# EAGLE design BluetoothModule (EAGLE 6.3)
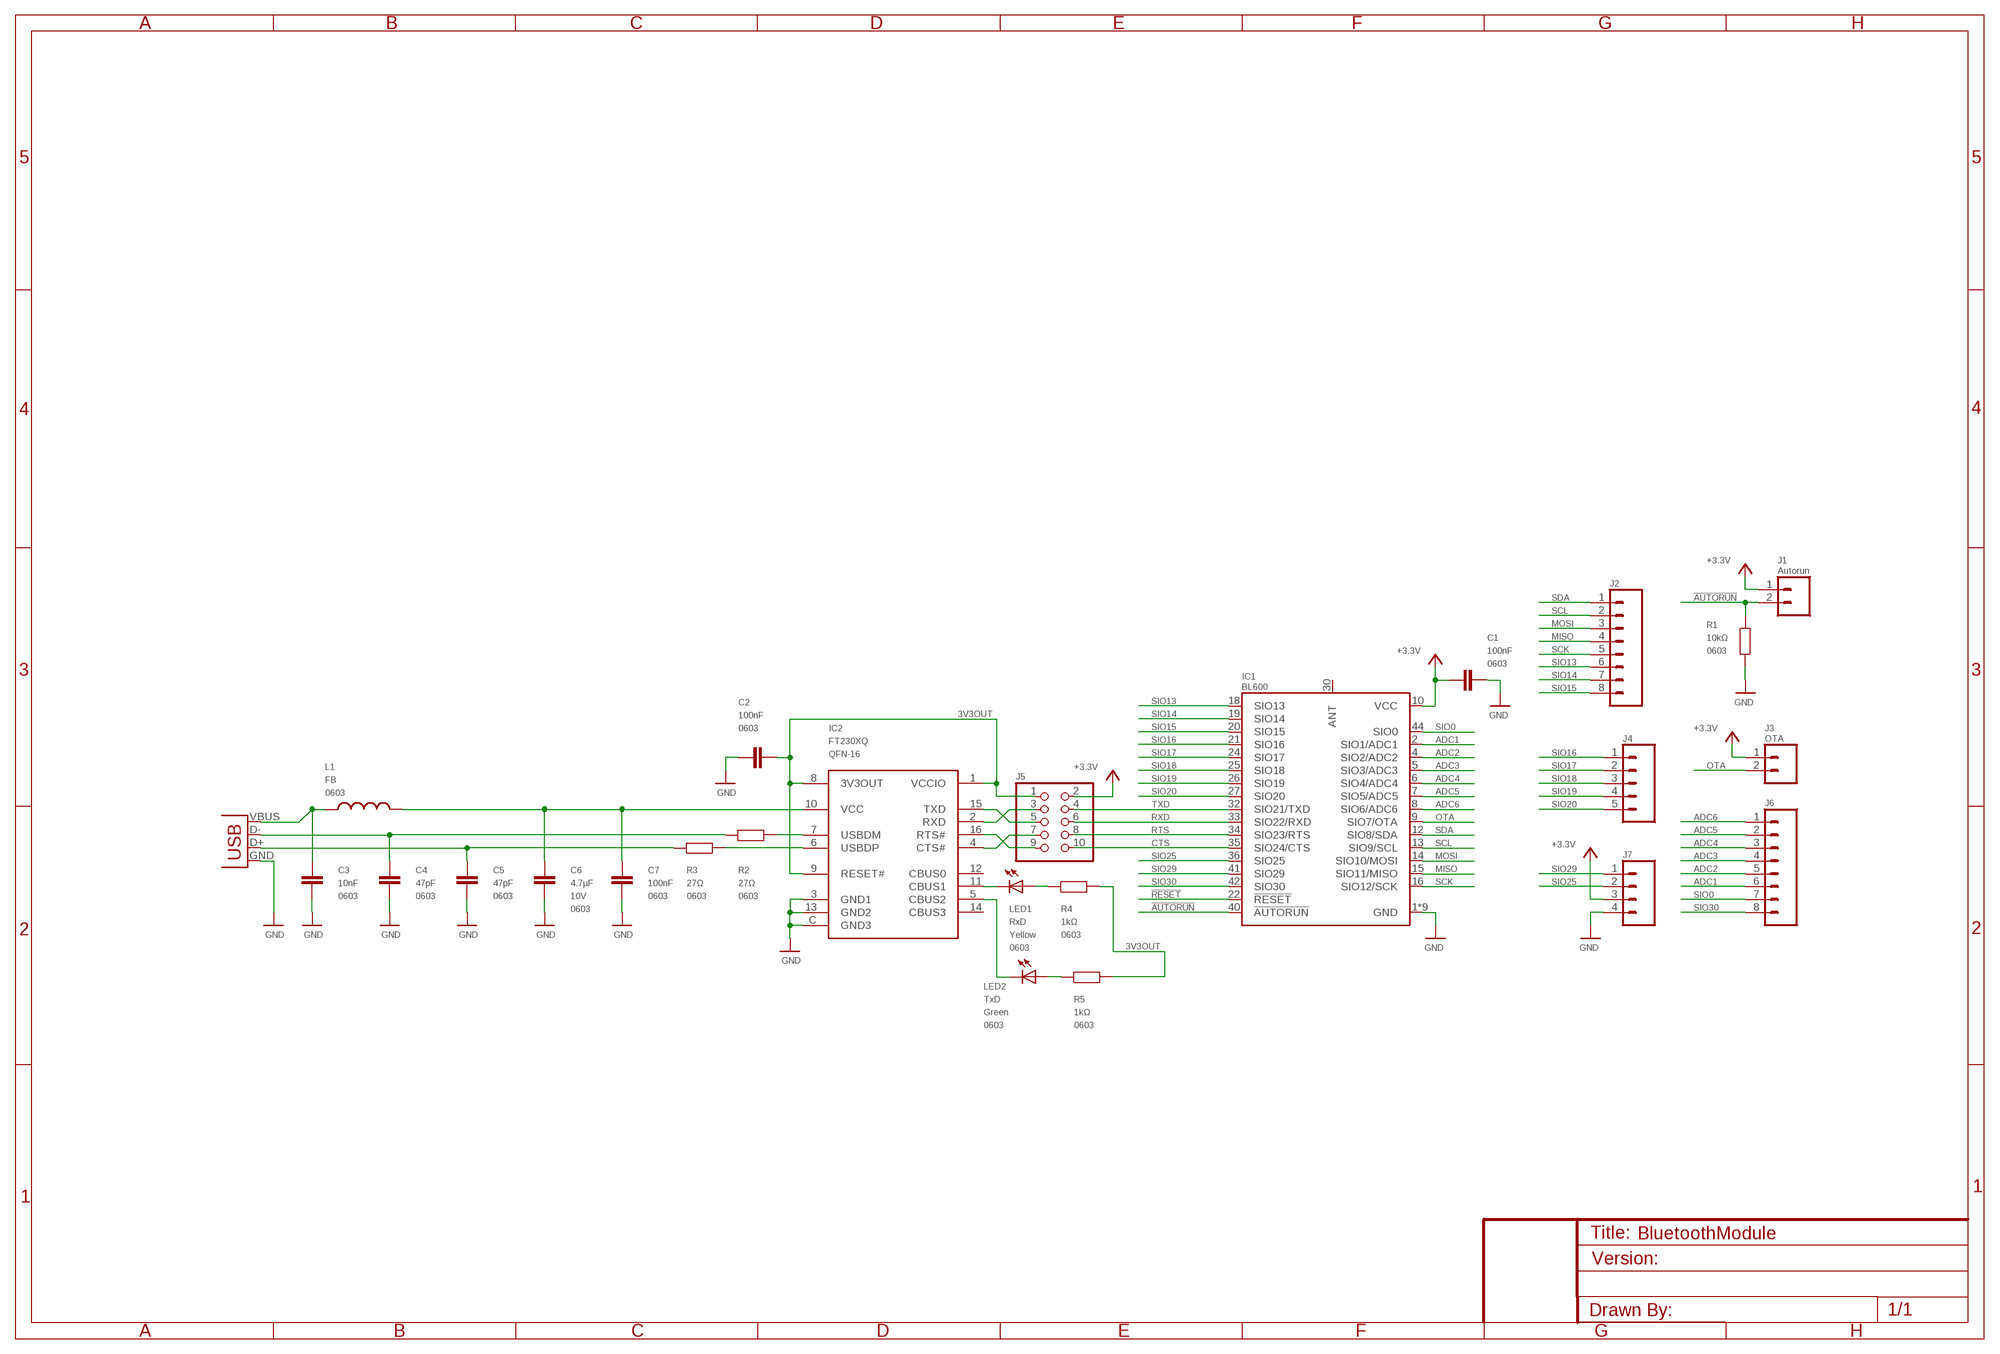
[diagram p0: schematic, sheet 1]

## Parts
C1  100nF  CAP0603  [0603]
C2  100nF  CAP0603  [0603]
C3  10nF  CAP0603  [0603]
C4  47pF  CAP0603  [0603]
C5  47pF  CAP0603  [0603]
C6  4.7µF  CAP0603  [0603]
C7  100nF  CAP0603  [0603]
IC1  BL600  [BL600-SA]
IC2  FT230XQ  [QFN4X4-16]
J1  Autorun  M02PTH  [1X02]
J2  M08STD  [1X08]
J3  OTA  M02PTH  [1X02]
J4  M05PTH  [1X05]
J5  PINHD-2X5  [2X05]
J6  M08STD  [1X08]
J7  M04PTH  [1X04]
J8  USB  USB-MICROB  [USB-MICROB]
L1  FB  INDUCTOR0603  [0603]
LED1  RxD  LED0603  [LED-0603]
LED2  TxD  LED0603  [LED-0603]
R1  10kΩ  RESISTOR0603  [0603]
R2  27Ω  RESISTOR0603  [0603]
R3  27Ω  RESISTOR0603  [0603]
R4  1kΩ  RESISTOR0603  [0603]
R5  1kΩ  RESISTOR0603  [0603]

## Nets
3V3OUT: C2.2 IC2.1(VCCIO) IC2.8(3V3OUT) IC2.9(RESET#) J5.1 R4.2 R5.2
!AUTORUN: IC1.40(!AUTORUN) J1.2 R1.2
!RESET: IC1.22(!RESET)
+3V3: C1.2 IC1.10(VCC) J1.1 J3.1 J5.2 J7.3 ; supply symbol labelled +3.3V
ADC1: IC1.2(SIO1/ADC1) J6.6
ADC2: IC1.4(SIO2/ADC2) J6.5
ADC3: IC1.5(SIO3/ADC3) J6.4
ADC4: IC1.6(SIO4/ADC4) J6.3
ADC5: IC1.7(SIO5/ADC5) J6.2
ADC6: IC1.8(SIO6/ADC6) J6.1
CTS: IC1.35(SIO24/CTS) J5.10
GND: C1.1 C2.1 C3.1 C4.1 C5.1 C6.1 C7.1 IC1.1(GND) IC1.3(GND) IC1.11(GND) IC1.17(GND) IC1.28(GND) IC1.29(GND) IC1.31(GND) IC1.37(GND) IC1.43(GND) IC2.3(GND1) IC2.13(GND2) IC2.C(GND3) J7.4 J8.GND R1.1
MISO: IC1.15(SIO11/MISO) J2.4
MOSI: IC1.14(SIO10/MOSI) J2.3
N$1: IC2.4(CTS#) J5.7
N$2: IC2.16(RTS#) J5.9
N$3: IC2.2(RXD) J5.3
N$4: IC2.15(TXD) J5.5
N$5: C3.2 J8.VBUS L1.1
N$6: LED2.A R5.1
N$7: IC2.11(CBUS1) LED1.C
N$8: IC2.5(CBUS2) LED2.C
N$9: LED1.A R4.1
N$10: C6.2 C7.2 IC2.10(VCC) L1.2
N$11: C4.2 J8.D- R2.1
N$12: C5.2 J8.D+ R3.1
N$13: IC2.6(USBDP) R3.2
N$14: IC2.7(USBDM) R2.2
OTA: IC1.9(SIO7/OTA) J3.2
RTS: IC1.34(SIO23/RTS) J5.8
RXD: IC1.33(SIO22/RXD) J5.6
SCK: IC1.16(SIO12/SCK) J2.5
SCL: IC1.13(SIO9/SCL) J2.2
SDA: IC1.12(SIO8/SDA) J2.1
SIO0: IC1.44(SIO0) J6.7
SIO13: IC1.18(SIO13) J2.6
SIO14: IC1.19(SIO14) J2.7
SIO15: IC1.20(SIO15) J2.8
SIO16: IC1.21(SIO16) J4.1
SIO17: IC1.24(SIO17) J4.2
SIO18: IC1.25(SIO18) J4.3
SIO19: IC1.26(SIO19) J4.4
SIO20: IC1.27(SIO20) J4.5
SIO25: IC1.36(SIO25) J7.2
SIO29: IC1.41(SIO29) J7.1
SIO30: IC1.42(SIO30) J6.8
TXD: IC1.32(SIO21/TXD) J5.4
Unconnected: IC1.30(ANT) IC2.12(CBUS0) IC2.14(CBUS3)

## Library data of the parts
C1-C5 C7 = freetronics-master-v1:CAP: Capacitor Standard 0603 ceramic capacitor, and 0.1" leaded capacitor.; PACKAGE: 0603
C6 = freetronics-master-v1:CAP: Capacitor Standard 0603 ceramic capacitor, and 0.1" leaded capacitor.; PACKAGE: 0603; VOLTAGE: 10V
IC1 = freetronics-luke:BL600: Laird BL600 Bluetooth Low Energy module
IC2 = serial:FT230XQ; PACKAGE: QFN-16; VALUE2: FT230XQ
J1 J3 = freetronics-master-v1:M02: Header 2 Standard 2-pin 0.1" header. Use with straight break away headers (SKU : PRT-00116), right angle break away headers (PRT-00553), swiss pins (PRT-00743), machine pins (PRT-00117), and female headers (PRT-00115). Molex polarized connector foot print use with SKU : PRT-08233 with associated crimp pins and housings.
J2 J6 = freetronics-master-v1:M08: Header 8 Standard 8-pin 0.1" header. Use with straight break away headers (SKU : PRT-00116), right angle break away headers (PRT-00553), swiss pins (PRT-00743), machine pins (PRT-00117), and female headers (PRT-00115).
J4 = freetronics-master-v1:M05: Header 5 Standard 5-pin 0.1" header. Use with straight break away headers (SKU : PRT-00116), right angle break away headers (PRT-00553), swiss pins (PRT-00743), machine pins (PRT-00117), and female headers (PRT-00115). Molex polarized connector foot print use with SKU : PRT-08230 with associated crimp pins and housings.
J5 = pinhead:PINHD-2X5: PIN HEADER
J7 = freetronics-master-v1:M04: Header 4 Standard 4-pin 0.1" header. Use with straight break away headers (SKU : PRT-00116), right angle break away headers (PRT-00553), swiss pins (PRT-00743), machine pins (PRT-00117), and female headers (PRT-00115). Molex polarized connector foot print use with SKU : PRT-08231 with associated crimp pins and housings.
J8 = freetronics-master-v1:USB: USB Connectors USB-B-PTH is fully proven SKU : PRT-00139 USB-miniB is fully proven SKU : PRT-00587 USB-A-PCB is untested. USB-A-H is throughly reviewed, but untested. Spark Fun Electronics SKU : PRT-00437 USB-B-SMT is throughly reviewed, but untested. Needs silkscreen touching up. USB-A-S has not been used/tested USB-MB-H has not been used/tested
L1 = freetronics-master-v1:INDUCTOR: Inductors Basic Inductor/Choke - 0603 and 1206. Footprints are not proven and vary greatly between part numbers.; PACKAGE: 0603
LED1 = freetronics-master-v1:LED: LEDs Standard schematic elements and footprints for 5mm, 3mm, 1206, and 0603 sized LEDs. 5mm - Spark Fun Electronics SKU : COM-00529 (and others); COLOR: Yellow; PACKAGE: 0603
LED2 = freetronics-master-v1:LED: LEDs Standard schematic elements and footprints for 5mm, 3mm, 1206, and 0603 sized LEDs. 5mm - Spark Fun Electronics SKU : COM-00529 (and others); COLOR: Green; PACKAGE: 0603
R1-R5 = freetronics-master-v1:RESISTOR: Resistor Basic schematic elements and footprints for 0603, 1206, and PTH 1/10th watt (small) resistors.; PACKAGE: 0603

## Board
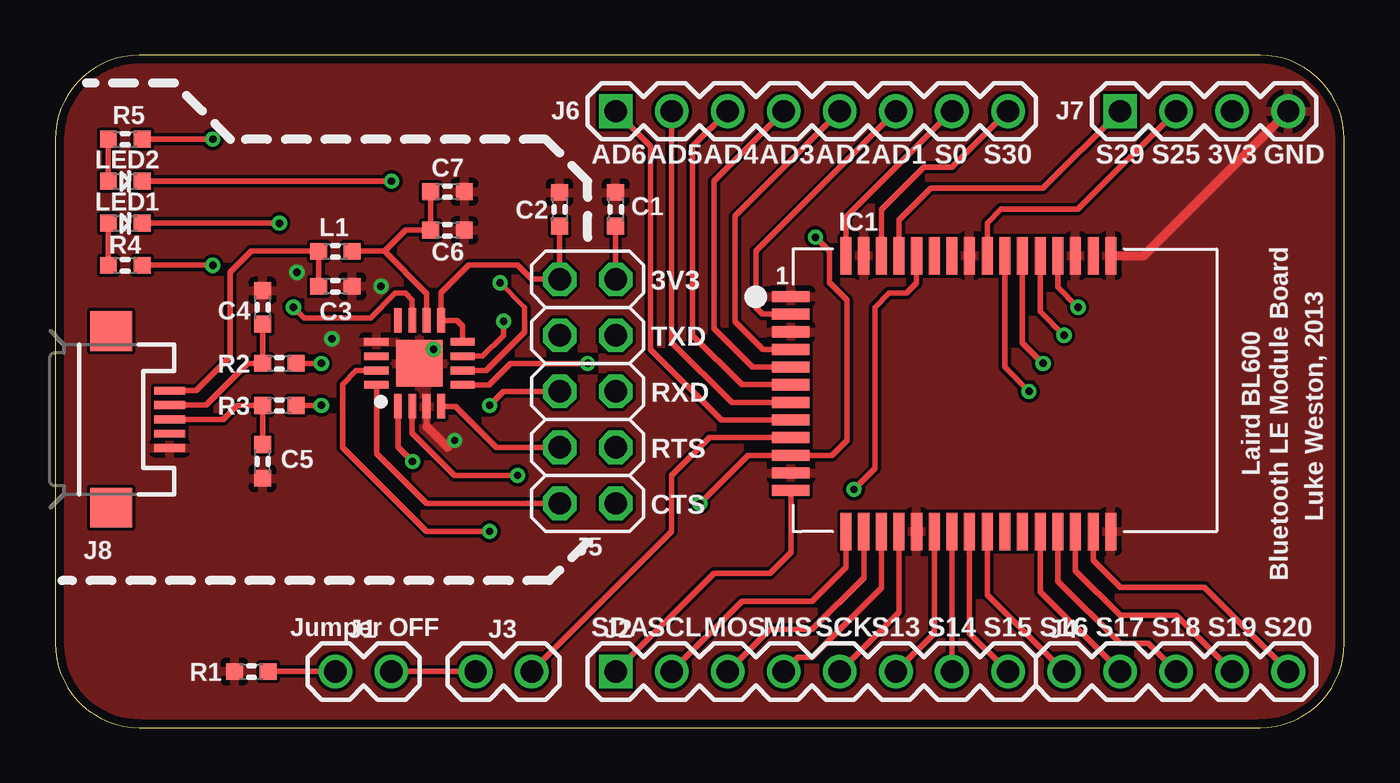
[diagram p1: board, top side]
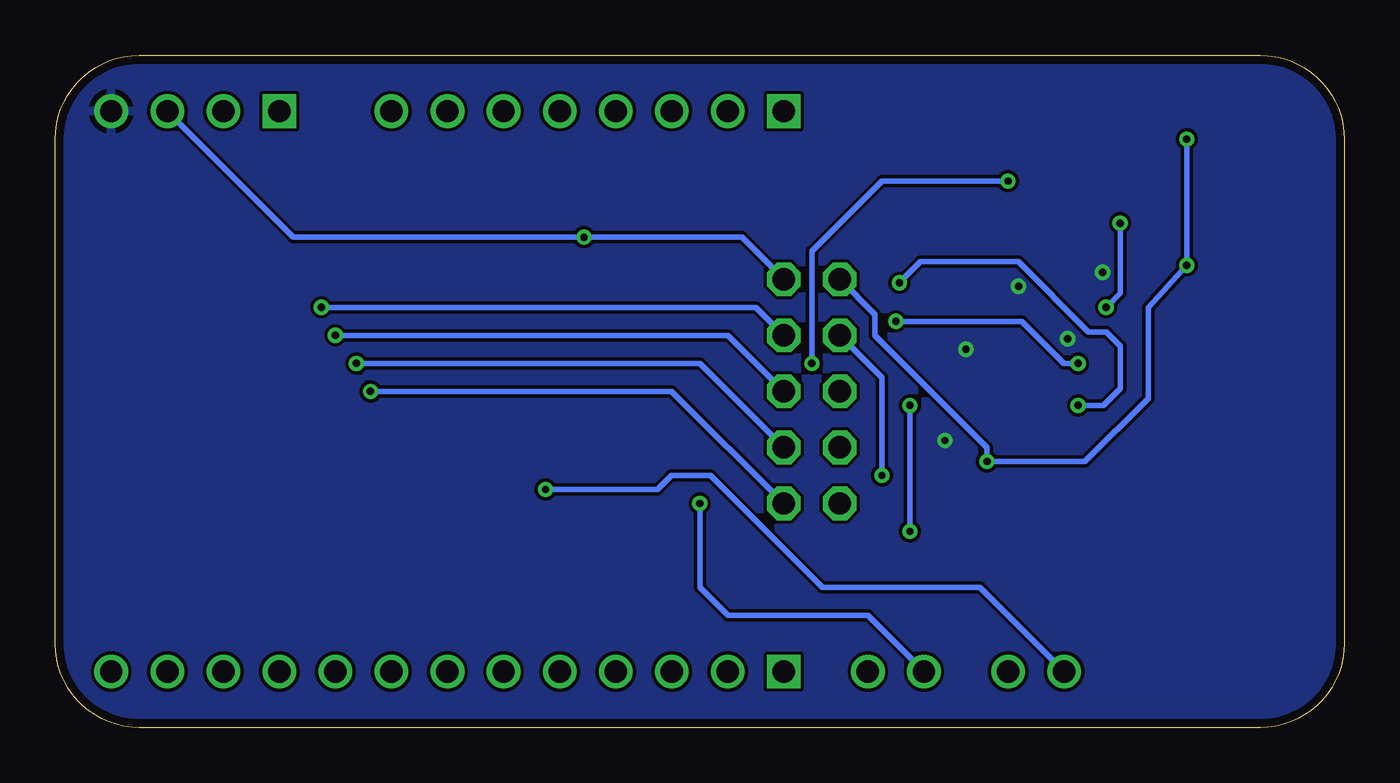
[diagram p2: board, bottom side, seen from below]

Size 58.42 x 30.48 mm. Coordinates in mm from the lower left corner, seen from the top.
Outline: 3.81,30.48 arc90 0,26.67 0,3.81 arc90 3.81,0 54.61,0 arc90 58.42,3.81 58.42,26.67 arc90 54.61,30.48 3.81,30.48
Copper layers (1*16): Top 0.0356mm / dielectric 1.5011mm / Bottom 0.0356mm
Design rules "LaenPCBOrder *": minimum track width 6mil, minimum drill 13mil, track to track 6mil, track to pad 6mil, pad to pad 6mil, via to via 6mil, smd to smd 6mil, copper to edge 15mil, drill to drill 6mil, minimum pad ring 7mil, minimum via ring 7mil, stop-mask expansion 4mil, vias tented up to drill 14mil, thermal gap 10mil

### Footprints (pad centres in the part's own frame; a part is rotated, then mirrored left to right if it is on the bottom)
0603 = smd 0.762 x 0.762: 1 -0.762,0; 2 0.762,0
BL600-SA = smd 1.7 x 0.5: 1 -2.5,10.65; 2 -2.5,9.85; 3 -2.5,9.05; 4 -2.5,8.25; 5 -2.5,7.45; 6 -2.5,6.65; 7 -2.5,5.85; 8 -2.5,5.05; 9 -2.5,4.25; 10 -2.5,3.45; 11 -2.5,2.65; 12 -2.5,1.85 | smd 0.5 x 1.7: 13 0,0; 14 0.8,0; 15 1.6,0; 16 2.4,0; 17 3.2,0; 18 4,0; 19 4.8,0; 20 5.6,0; 21 6.4,0; 22 7.2,0; 23 8,0; 24 8.8,0; 25 9.6,0; 26 10.4,0; 27 11.2,0; 28 12,0; 29 12,12.5; 30 11.2,12.5; 31 10.4,12.5; 32 9.6,12.5; 33 8.8,12.5; 34 8,12.5; 35 7.2,12.5; 36 6.4,12.5; 37 5.6,12.5; 38 4.8,12.5; 39 4,12.5; 40 3.2,12.5; 41 2.4,12.5; 42 1.6,12.5; 43 0.8,12.5; 44 0,12.5
QFN4X4-16 = smd 1.1 x 0.35: 1 -1.95,0.975; 2 -1.95,0.325; 3 -1.95,-0.325; 4 -1.95,-0.975; 9 1.95,-0.975; 10 1.95,-0.325; 11 1.95,0.325; 12 1.95,0.975 | smd 0.35 x 1.1: 5 -0.975,-1.95; 6 -0.325,-1.95; 7 0.325,-1.95; 8 0.975,-1.95; 13 0.975,1.95; 14 0.325,1.95; 15 -0.325,1.95; 16 -0.975,1.95 | smd 2.1 x 2.1: C 0,0
1X02 = drill 1.016: 1 0,0; 2 2.54,0
1X08 = drill 1.016 square: 1 0,0 | drill 1.016: 2 2.54,0; 3 5.08,0; 4 7.62,0; 5 10.16,0; 6 12.7,0; 7 15.24,0; 8 17.78,0
1X05 = drill 1.016: 1 0,0; 2 2.54,0; 3 5.08,0; 4 7.62,0; 5 10.16,0
2X05 = drill 1.016 octagon: 1 -5.08,-1.27; 2 -5.08,1.27; 3 -2.54,-1.27; 4 -2.54,1.27; 5 0,-1.27; 6 0,1.27; 7 2.54,-1.27; 8 2.54,1.27; 9 5.08,-1.27; 10 5.08,1.27
1X04 = drill 1.016 square: 1 0,0 | drill 1.016: 2 2.54,0; 3 5.08,0; 4 7.62,0
USB-MICROB = smd 0.35 x 1.4: D+ 0,2.65; D- -0.65,2.65; GND 1.3,2.65; ID 0.65,2.65; VBUS -1.3,2.65 | smd 1.8 x 1.9: MT1 -4,0; MT2 4,0
LED-0603 = smd 0.762 x 0.762: A -0.762,0; C 0.762,0

### Placement (x,y rotation side)
C1  25.4,23.5 270 top
C2  22.86,23.5 270 top
C3  12.7,20 180 top
C4  9.4,19.05 270 top
C5  9.4,12.06 90 top
C6  17.78,22.54 180 top
C7  17.78,24.29 180 top
IC1  35.84,8.89 0 top
IC2  16.51,16.51 90 top
J1  15.24,2.54 180 top
J2  25.4,2.54 0 top
J3  19.05,2.54 0 top
J4  45.72,2.54 0 top
J5  24.13,15.24 270 top
J6  25.4,27.94 0 top
J7  48.26,27.94 0 top
J8  2.54,13.97 270 top
L1  12.7,21.59 0 top
LED1  3.17,22.86 0 top
LED2  3.17,24.77 0 top
R1  8.89,2.54 0 top
R2  10.16,16.51 0 top
R3  10.16,14.61 0 top
R4  3.17,20.95 0 top
R5  3.17,26.67 0 top

### Tracks (layer width: path | path; a pad name or v marks a point on that pad's centre or on a via)
3V3OUT  (via drill 0.33)
  Top 0.254: IC2.1 15.54,12.72 v16.19,12.06 | C2.2 J5.1 21.59,20.32 20.95,20.95 18.73,20.95 17.48,19.71 IC2.9 18.21,18.46 18.46,18.21 IC2.8 | R4.2 v7.14,20.95 | v7.14,26.67 R5.2
  Bottom 0.254: J5.1 21.27,18.73 21.27,17.78 16.19,12.7 v16.19,12.06 11.75,12.06 8.89,14.92 8.89,19.05 v7.14,20.95 v7.14,26.67
!AUTORUN  (via drill 0.33)
  Top 0.254: R1.2 J1.2 | IC1.40 39.04,20.15 38.58,19.68 37.78,19.68 37.15,19.05 37.15,11.75 v36.2,10.79
  Bottom 0.254: v36.2,10.79 31.11,10.79 30.48,11.43 28.73,11.43 23.65,6.35 16.51,6.35 J1.2
+3V3  (via drill 0.33)
  Top 0.254: v34.45,22.23 35.08,21.59 35.08,20.16 35.88,19.37 35.88,13.02 35.2,12.34 IC1.10 31.39,12.34 v29.21,10.16 | C1.2 J5.2 | J1.1 J3.1
  Bottom 0.254: J7.3 47.62,22.23 v34.45,22.23 27.3,22.23 J5.2 | v29.21,10.16 29.21,6.35 27.94,5.08 21.59,5.08 J3.1
ADC1
  Top 0.254: IC1.2 32.06,18.74 31.75,19.05 31.75,21.59 J6.6
ADC2
  Top 0.254: IC1.4 32.07,17.14 30.8,18.41 30.8,23.18 J6.5
ADC3
  Top 0.254: IC1.5 31.6,16.34 29.84,18.1 29.84,24.77 J6.4
ADC4
  Top 0.254: IC1.6 31.13,15.54 28.89,17.78 28.89,26.35 J6.3
ADC5
  Top 0.254: IC1.7 30.66,14.74 27.94,17.46 J6.2
ADC6
  Top 0.254: IC1.8 30.19,13.94 26.99,17.14 26.99,26.35 J6.1
CTS  (via drill 0.33)
  Top 0.254: IC1.35 43.04,16.33 v44.13,15.24
  Bottom 0.254: v44.13,15.24 30.48,15.24 J5.10
GND  (via drill 0.33)
  Top 0.254: IC2.3 16.84,13.64 | IC2.C v17.14,17.14
  Top 0.406: IC1.29 49.33,21.39 J7.4 | 16.84,13.64 17.78,12.7
  other vias: 18.1,13.02 12.54,17.62 10.95,20.64 14.76,20
  pour Bottom: -1.27,31.75 59.69,31.75 59.69,-1.27 -1.27,-1.27
  pour Top: -1.27,31.75 59.69,31.75 59.69,-1.27 -1.27,-1.27
MISO
  Top 0.254: IC1.15 37.44,6.33 34.29,3.17 33.66,3.17 J2.4
MOSI
  Top 0.254: IC1.14 36.64,6.79 34.29,4.45 32.38,4.45 J2.3
N$1
  Top 0.254: IC2.4 18.14,14.56 20,12.7 J5.7
N$2
  Top 0.254: IC2.16 14.56,12.43 16.83,10.16 J5.9
N$3  (via drill 0.33)
  Top 0.254: IC2.2 16.18,13.34 18.1,11.43 v20.95,11.43
  Bottom 0.254: v20.95,11.43 20.95,15.88 J5.3
N$4  (via drill 0.33)
  Top 0.254: IC2.15 13.64,16.18 13.02,15.56 13.02,12.7 16.83,8.89 v19.68,8.89 | v19.68,14.61 20.32,15.24 J5.5
  Bottom 0.254: v19.68,8.89 v19.68,14.61
N$5
  Top 0.254: C3.2 L1.1 8.89,21.59 7.94,20.64 7.94,16.83 6.38,15.27 J8.VBUS
N$6
  Top 0.254: R5.1 LED2.A
N$7  (via drill 0.33)
  Top 0.254: IC2.11 16.18,19.38 15.88,19.68 15.4,19.68 14.29,18.57 11.27,18.57 v10.79,19.05 | LED1.C v10.16,22.86
  Bottom 0.254: v10.16,22.86 10.16,19.68 v10.79,19.05
N$8  (via drill 0.33)
  Top 0.254: IC2.5 19.66,15.54 20.64,16.51 v24.13,16.51 | LED2.C v15.24,24.77
  Bottom 0.254: v15.24,24.77 20.95,24.77 24.13,21.59 v24.13,16.51
N$9
  Top 0.254: LED1.A R4.1
N$10
  Top 0.254: IC2.10 16.84,19.68 14.92,21.59 | 14.92,21.59 L1.2 | 14.92,21.59 15.88,22.54 C6.2 C7.2
N$11
  Top 0.254: C4.2 R2.1 8.73,16.51 6.84,14.62 J8.D-
N$12
  Top 0.254: C5.2 R3.1 8.26,14.61 7.62,13.97 J8.D+
N$13  (via drill 0.33)
  Top 0.203: 21.27,19.05 v20.16,20.16
  Top 0.254: IC2.6 19.52,16.18 21.27,17.94 21.27,19.05 | v12.06,14.61 R3.2
  Bottom 0.254: v12.06,14.61 R3.2 10.16,15.37 10.16,17.3 10.79,17.94 11.59,17.94 14.76,21.11 19.21,21.11 v20.16,20.16
N$14  (via drill 0.33)
  Top 0.254: IC2.7 19.38,16.84 20.32,17.78 v20.32,18.41 | v12.06,16.51 R2.2
  Bottom 0.254: v20.32,18.41 14.61,18.41 12.7,16.51 v12.06,16.51
OTA
  Top 0.254: IC1.9 29.65,13.14 27.94,11.43 27.94,8.89 J3.2
RTS  (via drill 0.33)
  Top 0.254: IC1.34 43.84,17.44 v44.77,16.51
  Bottom 0.254: v44.77,16.51 29.21,16.51 J5.8
RXD  (via drill 0.33)
  Top 0.254: IC1.33 44.64,18.86 v45.72,17.78
  Bottom 0.254: v45.72,17.78 27.94,17.78 J5.6
SCK
  Top 0.254: IC1.16 38.24,5.22 J2.5
SCL
  Top 0.254: IC1.13 35.84,7.26 34.29,5.71 31.11,5.71 J2.2
SDA
  Top 0.254: IC1.12 33.34,7.94 32.38,6.99 29.84,6.99 J2.1
SIO0
  Top 0.254: IC1.44 35.84,23.14 J6.7
SIO13
  Top 0.254: IC1.18 39.84,4.28 J2.6
SIO14
  Top 0.254: IC1.19 J2.7
SIO15
  Top 0.254: IC1.20 41.44,4.28 J2.8
SIO16
  Top 0.254: IC1.21 42.24,6.02 J4.1
SIO17
  Top 0.254: IC1.24 44.64,6.16 J4.2
SIO18
  Top 0.254: IC1.25 45.44,6.63 48.26,3.81 49.53,3.81 J4.3
SIO19
  Top 0.254: IC1.26 46.24,7.1 48.26,5.08 50.8,5.08 J4.4
SIO20
  Top 0.254: IC1.27 47.04,7.57 48.26,6.35 52.07,6.35 J4.5
SIO25
  Top 0.254: IC1.36 42.24,22.87 42.86,23.5 46.35,23.5 J7.2
SIO29
  Top 0.254: IC1.41 38.24,23 39.69,24.45 44.77,24.45 J7.1
SIO30
  Top 0.254: IC1.42 37.44,23.47 39.37,25.4 40.64,25.4 J6.8
TXD  (via drill 0.33)
  Top 0.254: IC1.32 45.44,19.96 v46.35,19.05
  Bottom 0.254: v46.35,19.05 26.67,19.05 J5.4

### Text on the board
tPlace: AD6 | AD5 | AD4 | AD3 | AD2 | AD1 | S0 | S30 | S29 | S25 | 3V3 | GND | 3V3 | TXD | RXD | RTS | Laird BL600 | CTS | Luke Weston, 2013 | Bluetooth LE Module Board | Jumper OFF | SDA | SCL | MOS | MIS | SCK | S13 | S14 | S15 | S16 | S17 | S18 | S19 | S20
tValues: FT230XQ